# Altium schematic sheet SD Card.SchDoc
size A4
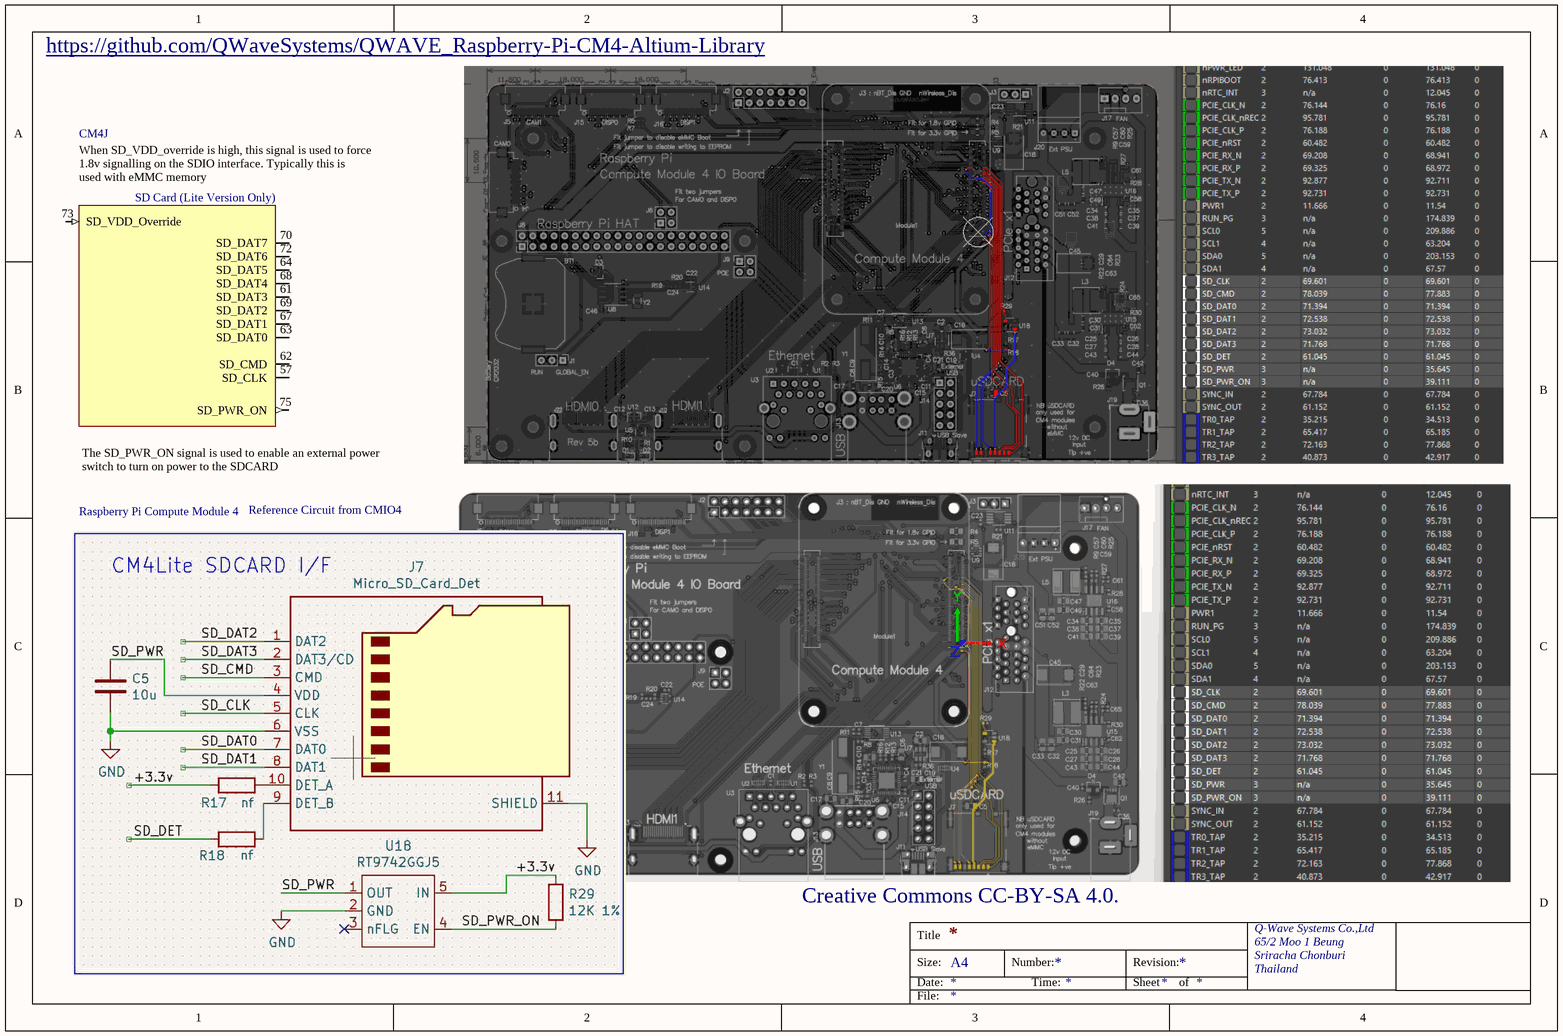
[diagram p0: SD Card.SchDoc]

## Parts
CM4  Raspberry Pi Compute Module 4  [CM4-F40C-100DS-0.4v_1.5mm_0mm]  (part J of 21)  (no BOM)

## Nets

Not connected (* = marked no-connect by the designer): CM4 57(SD_CLK) 61(SD_DAT3) 62(SD_CMD) 63(SD_DAT0) 64(SD_DAT5) 67(SD_DAT1) 68(SD_DAT4) 69(SD_DAT2) 70(SD_DAT7) 72(SD_DAT6) 73(SD_VDD_Override) 75(SD_PWR_ON)

## Notes on the sheet
- https://github.com/QWaveSystems/QWAVE_Raspberry-Pi-CM4-Altium-Library
- Reference Circuit from CMIO4
- Creative Commons CC-BY-SA 4.0.
- Title
- Size:
- Date:
- A4
- Number:
- Time:
- Revision:
- Sheet
- of
- Q-Wave Systems Co.,Ltd
- 65/2 Moo 1 Beung
- Sriracha Chonburi
- Thailand
- File:
- (in symbol CM4, part J) When SD_VDD_override is high, this signal is used to force 1.8v signalling on the SDIO interface. Typically this is / used with eMMC memory; SD Card (Lite Version Only); by Amornthep Phunsin; The SD_PWR_ON signal is used to enable an external power switch to turn on power to the SDCARD

## Library data of the parts
CM4 = CM4: Raspberry Pi Compute Module 4 by Amornthep Phunsin